# EAGLE design ButtonsBreakout (EAGLE 7.2.0)
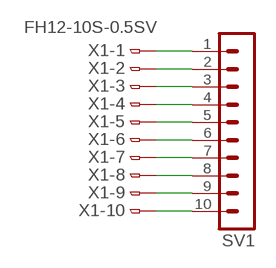
[diagram p0: schematic, sheet 1]

## Parts
SV1  MA10-1W  [MA10-1W]
X1  FH12-10S-0.5SV  [FH12-10S-0.5SV]

## Nets
N$1: SV1.1 X1.1
N$2: SV1.2 X1.2
N$3: SV1.3 X1.3
N$4: SV1.4 X1.4
N$5: SV1.5 X1.5
N$6: SV1.6 X1.6
N$7: SV1.7 X1.7
N$8: SV1.8 X1.8
N$9: SV1.9 X1.9
N$10: SV1.10 X1.10

## Library data of the parts
SV1 = con-lstb:MA10-1W: PIN HEADER; OC_FARNELL: unknown; OC_NEWARK: unknown
X1 = own-collection:FH12-10S-0.5S: 0.5mm Pitch Connectors For FPC/FFC Source: Data sheet <http://www.hirose.co.jp/cataloge_hp/e58605370.pdf>

## Board
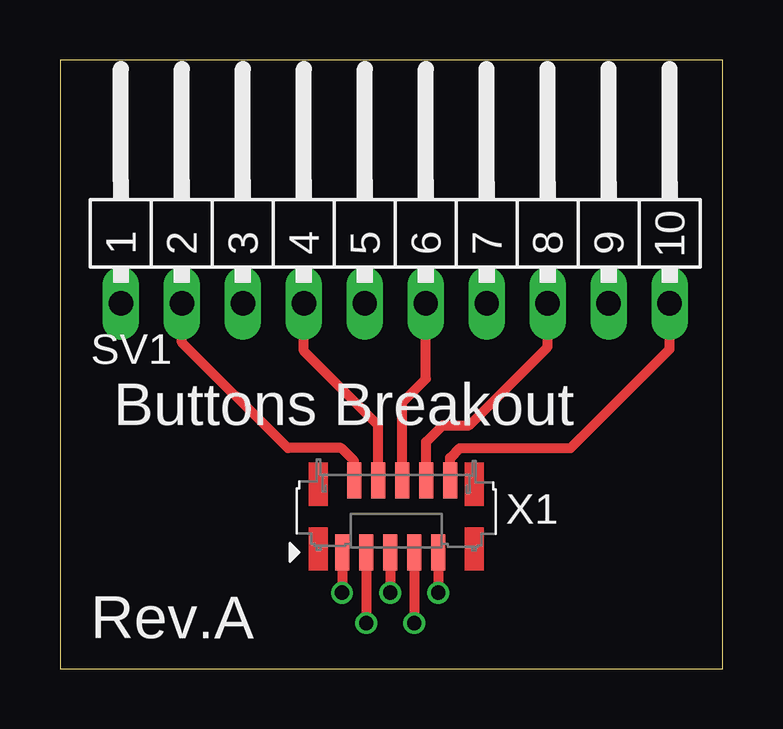
[diagram p1: board, top side]
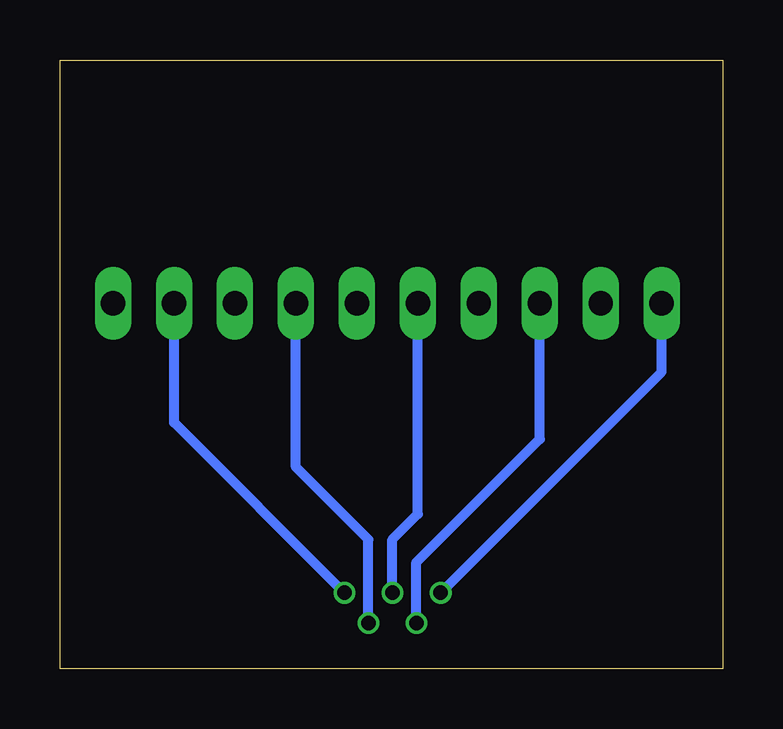
[diagram p2: board, bottom side, seen from below]

Size 27.61 x 25.39 mm. Coordinates in mm from the lower left corner, seen from the top.
Outline: 0,0 27.61,0 27.61,25.39 0,25.39 0,0
Copper layers (1*16): Top 0.035mm / dielectric 1.5mm / Bottom 0.035mm
Design rules "dirt_cheap_dirty_boards.v1": minimum track width 5mil, minimum drill 12mil, track to track 5mil, track to pad 5mil, pad to pad 5mil, via to via 5mil, smd to smd 0mil, copper to edge 10mil, drill to drill 10mil, minimum pad ring 10mil, minimum via ring 6mil, stop-mask expansion 2mil, vias tented up to drill 25mil, thermal gap 10mil

### Footprints (pad centres in the part's own frame; a part is rotated, then mirrored left to right if it is on the bottom)
MA10-1W = drill 1.016 long: 1 -11.43,0; 2 -8.89,0; 3 -6.35,0; 4 -3.81,0; 5 -1.27,0; 6 1.27,0; 7 3.81,0; 8 6.35,0; 9 8.89,0; 10 11.43,0
FH12-10S-0.5SV = smd 0.6 x 1.5: 1 -2.21,-1.5; 2 -1.71,1.5; 3 -1.21,-1.5; 4 -0.71,1.5; 5 -0.21,-1.5; 6 0.29,1.5; 7 0.79,-1.5; 8 1.29,1.5; 9 1.79,-1.5; 10 2.29,1.5

### Placement (x,y rotation side)
SV1  13.97,15.24 0 top
X1  13.97,6.35 0 top

### Tracks (layer width: path | path; a pad name or v marks a point on that pad's centre or on a via)
N$1  (via drill 0.6)
  Top 0.406: X1.1 v11.76,3.17 v11.75,3.17
  Bottom 0.406: v11.75,3.17 2.54,12.38 SV1.1
N$2
  Top 0.406: X1.2 12.26,8.66 11.72,9.21 9.49,9.21 5.08,13.62 SV1.2
N$3  (via drill 0.6)
  Top 0.406: X1.3 v12.76,1.91
  Bottom 0.406: v12.76,1.91 12.76,4.45 7.62,9.59 SV1.3
N$4
  Top 0.406: X1.4 13.26,10.16 10.16,13.26 SV1.4
N$5  (via drill 0.6)
  Top 0.406: X1.5 v13.76,3.17
  Bottom 0.406: v13.76,3.17 13.76,5.4 12.7,6.46 SV1.5
N$6
  Top 0.406: X1.6 14.26,11.11 15.24,12.09 SV1.6
N$7  (via drill 0.6)
  Top 0.406: X1.7 v14.76,1.91
  Bottom 0.406: v14.76,1.91 14.76,5.4 17.78,8.42 SV1.7
N$8
  Top 0.406: X1.8 15.26,9.47 15.95,10.16 17.05,10.16 20.32,13.43 SV1.8
N$9  (via drill 0.6)
  Top 0.406: X1.9 v15.76,3.17
  Bottom 0.406: v15.76,3.17 22.86,10.28 SV1.9
N$10
  Top 0.406: X1.10 16.26,8.8 16.66,9.21 21.27,9.21 25.4,13.34 SV1.10

### Text on the board
tNames: Buttons Breakout | Rev.A